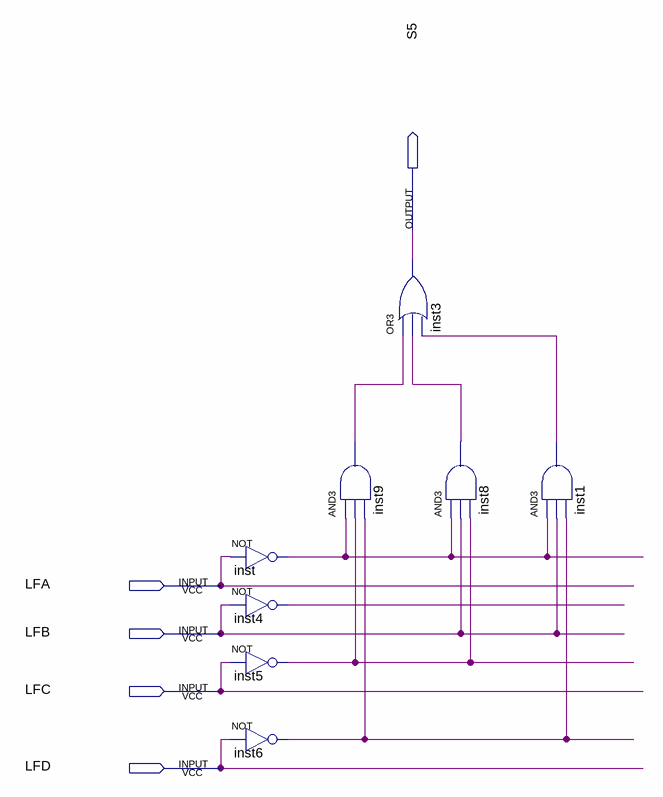
[diagram p0: schematic sheet]
// Quartus schematic Linha5.bdf as structural Verilog: 8 symbols, 5 pins
module Linha5 (
  input  LFA,
  input  LFB,
  input  LFC,
  input  LFD,
  output S5
);

  wire inst1_out, inst4_out, inst5_out, inst6_out, inst8_out, inst9_out, inst_out;

  not inst (inst_out, LFA);
  not inst4 (inst4_out, LFB);
  not inst5 (inst5_out, LFC);
  not inst6 (inst6_out, LFD);
  or inst3 (S5, inst9_out, inst8_out, inst1_out);
  and inst9 (inst9_out, inst_out, inst5_out, inst6_out);
  and inst8 (inst8_out, inst_out, LFB, inst5_out);
  and inst1 (inst1_out, inst_out, LFB, inst6_out);
endmodule
